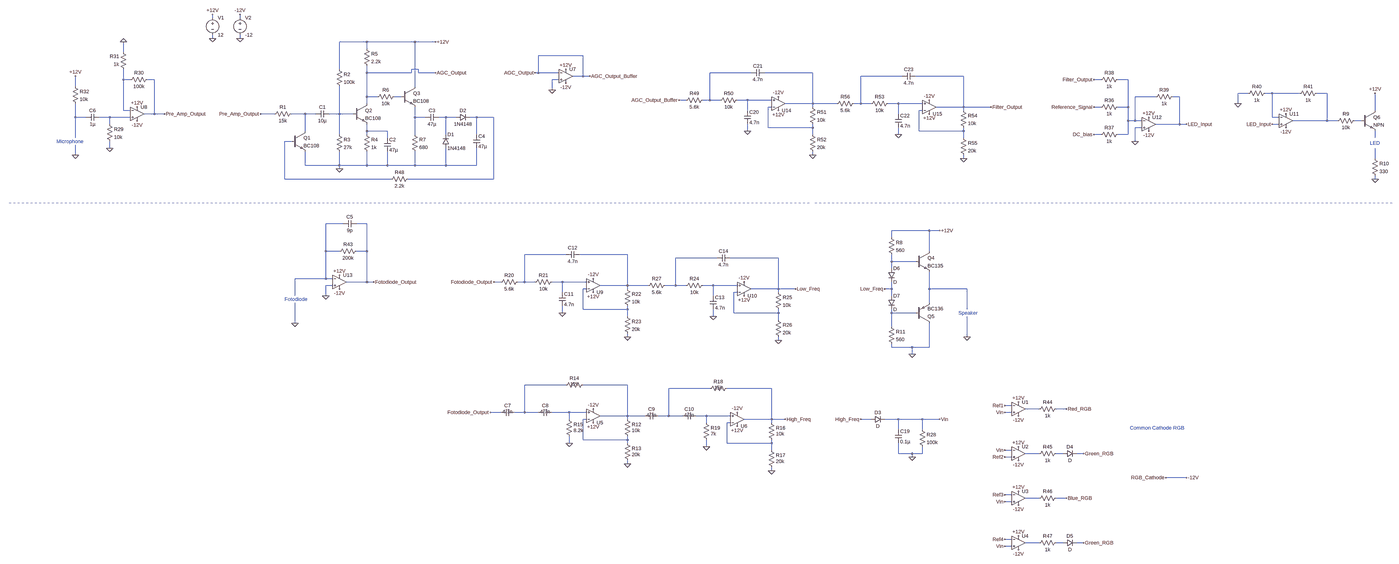
[diagram p0: schematic EE313_MenduhKesici_RafetKavak_CircuitSchematic.asc, whole sheet]
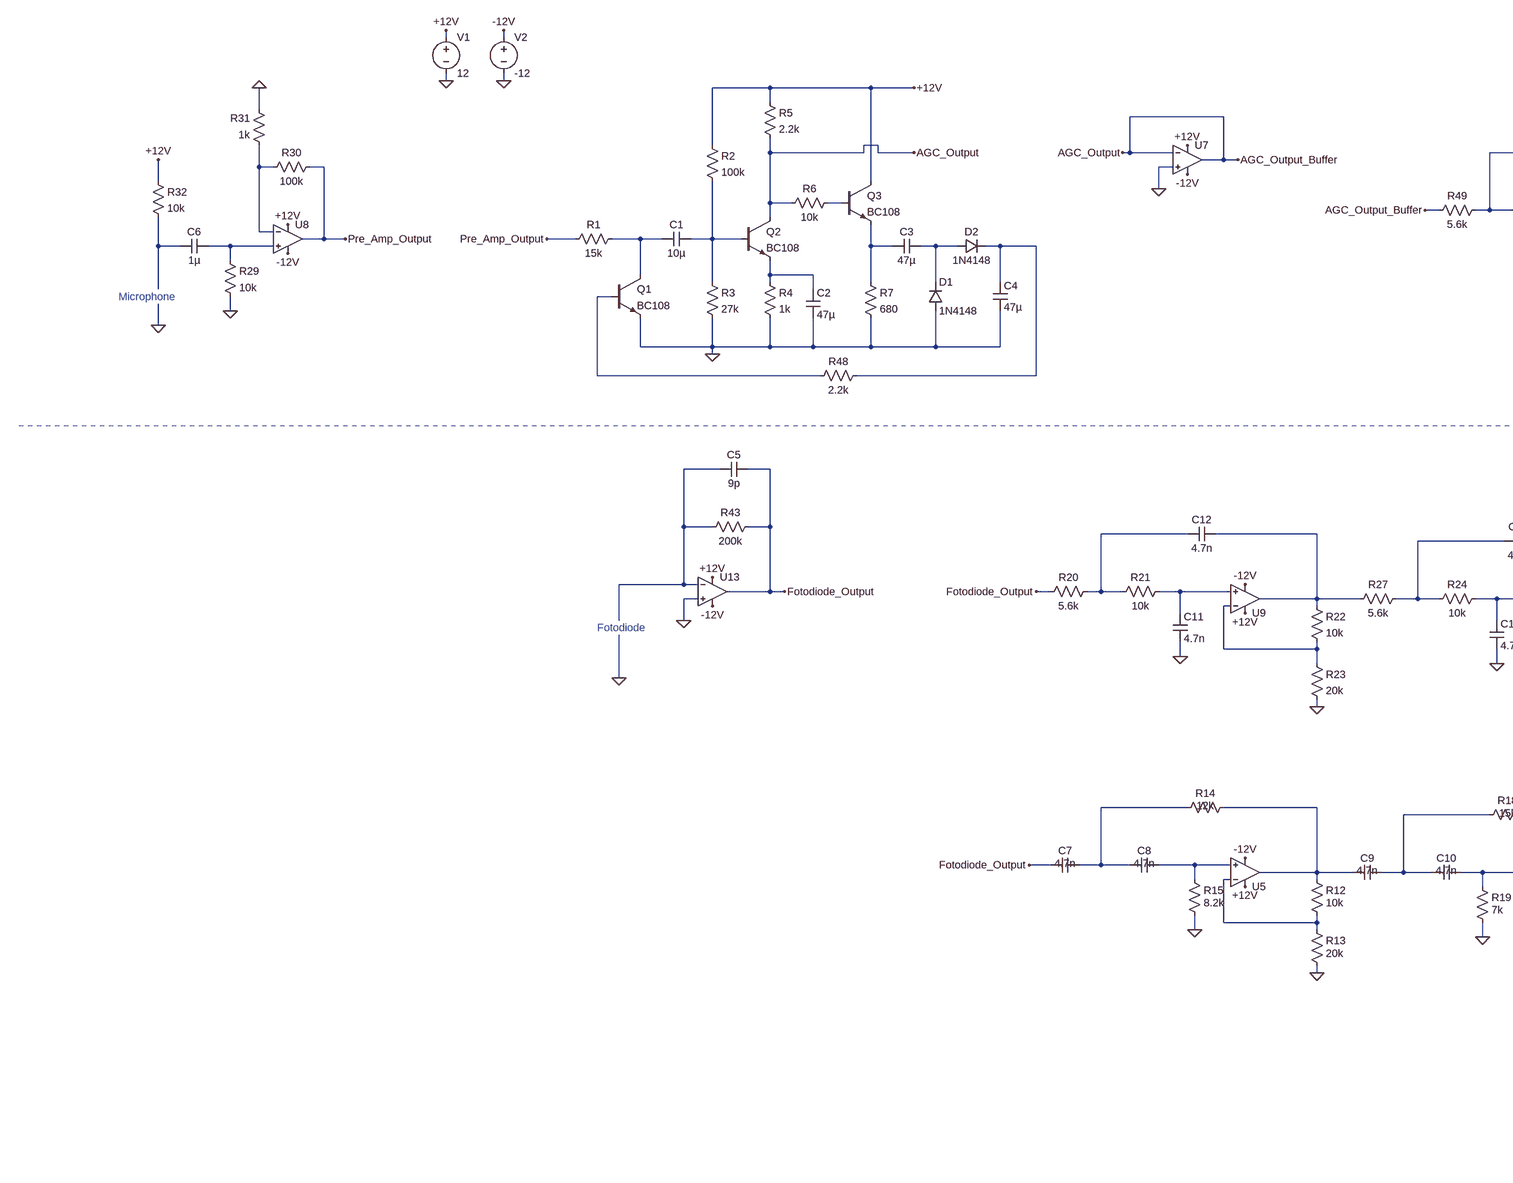
[diagram p1: schematic EE313_MenduhKesici_RafetKavak_CircuitSchematic.asc, part, row 1 of 1, column 1 of 2]
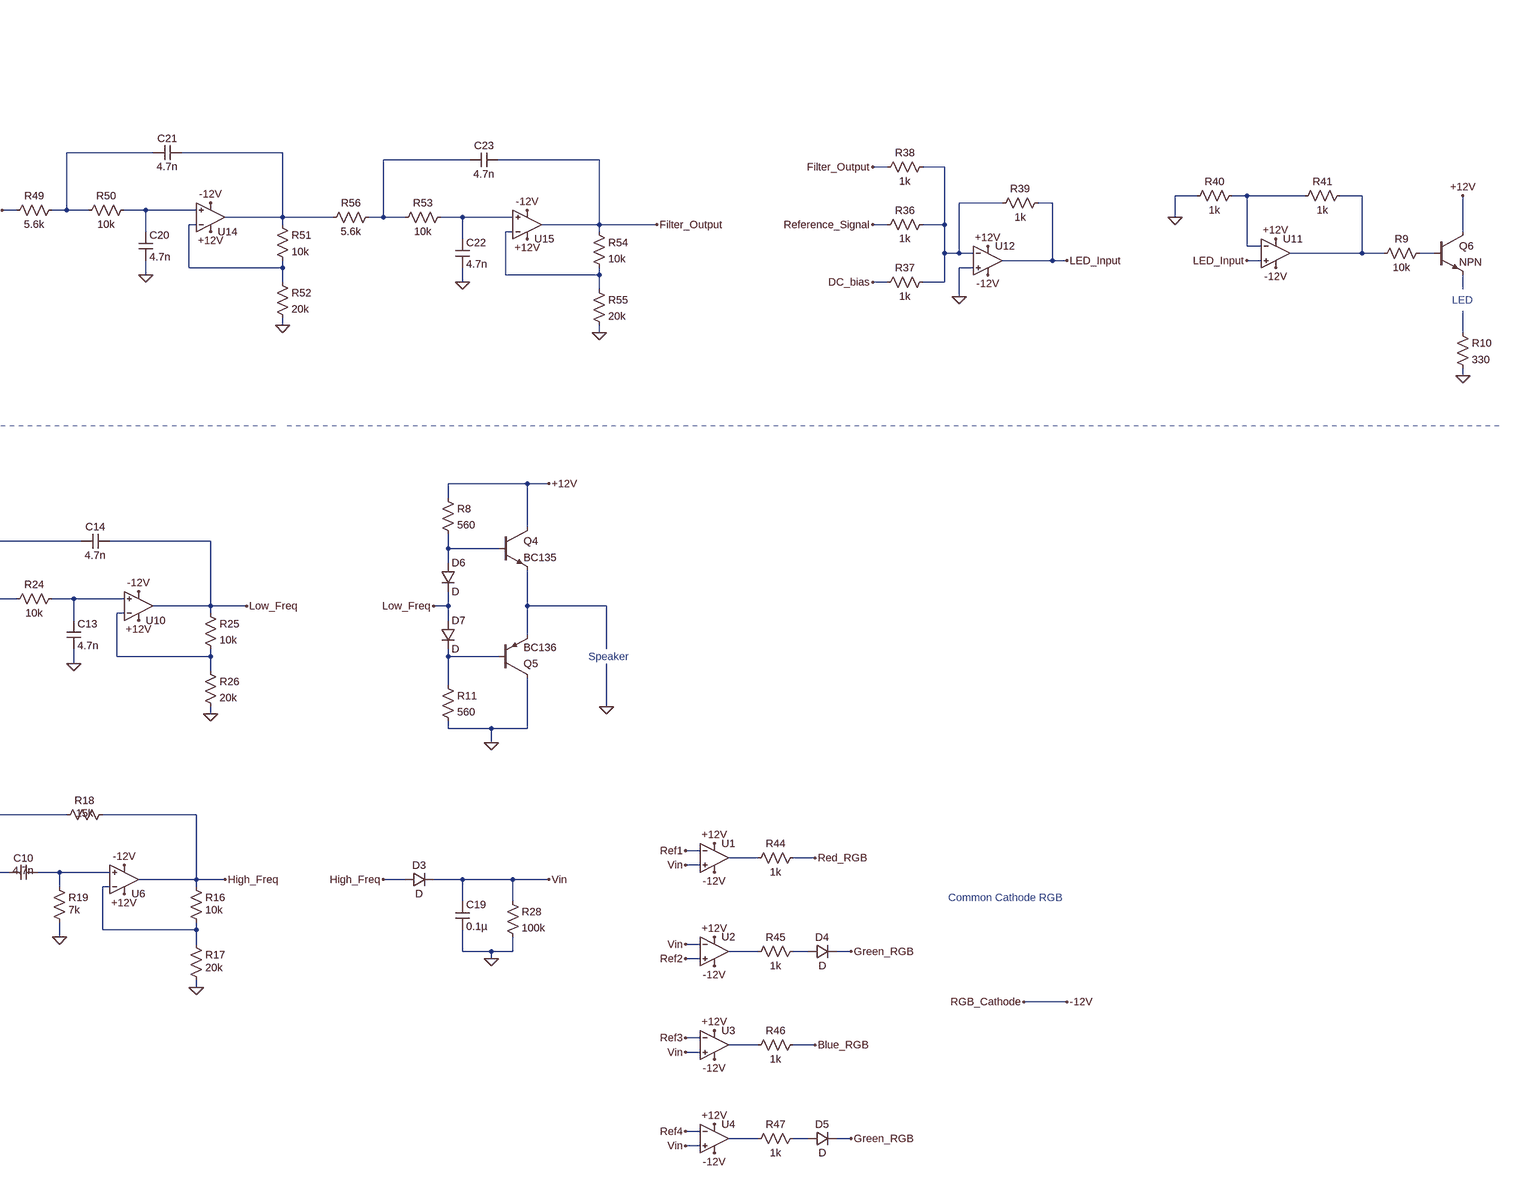
[diagram p2: schematic EE313_MenduhKesici_RafetKavak_CircuitSchematic.asc, part, row 1 of 1, column 2 of 2]
EE313_MenduhKesici_RafetKavak_CircuitSchematic.asc, the LTspice schematic file:
Version 4
SHEET 1 6596 3156
WIRE -2768 464 -2768 448
WIRE -2640 464 -2640 448
WIRE -2768 560 -2768 544
WIRE -2640 560 -2640 544
WIRE -2048 576 -2176 576
WIRE -1824 576 -2048 576
WIRE -1728 576 -1824 576
WIRE -2048 608 -2048 576
WIRE -3184 624 -3184 576
WIRE -1040 640 -1248 640
WIRE -2176 704 -2176 576
WIRE -1808 704 -1840 704
WIRE -2048 720 -2048 688
WIRE -1840 720 -1840 704
WIRE -1840 720 -2048 720
WIRE -1808 720 -1808 704
WIRE -1728 720 -1808 720
WIRE -1248 720 -1248 640
WIRE -1248 720 -1264 720
WIRE -1152 720 -1248 720
WIRE -256 720 -448 720
WIRE 32 720 -192 720
WIRE -1040 736 -1040 640
WIRE -1040 736 -1088 736
WIRE -1008 736 -1040 736
WIRE 448 736 256 736
WIRE 736 736 512 736
WIRE -3184 752 -3184 704
WIRE -3152 752 -3184 752
WIRE -3040 752 -3072 752
WIRE -1152 752 -1184 752
WIRE 1376 752 1344 752
WIRE 1504 752 1456 752
WIRE -3408 784 -3408 736
WIRE -1824 784 -1824 576
WIRE -1184 800 -1184 752
WIRE 2064 816 2016 816
WIRE 2176 816 2144 816
WIRE 2304 816 2176 816
WIRE 2432 816 2384 816
WIRE -2048 832 -2048 720
WIRE -2000 832 -2048 832
WIRE -1888 832 -1920 832
WIRE 1632 832 1536 832
WIRE 1744 832 1712 832
WIRE -560 848 -592 848
WIRE -448 848 -448 720
WIRE -448 848 -480 848
WIRE -400 848 -448 848
WIRE -272 848 -320 848
WIRE -160 848 -272 848
WIRE -2048 864 -2048 832
WIRE 32 864 32 720
WIRE 32 864 -96 864
WIRE 144 864 32 864
WIRE 256 864 256 736
WIRE 256 864 224 864
WIRE 304 864 256 864
WIRE 432 864 384 864
WIRE 544 864 432 864
WIRE 2016 864 2016 816
WIRE -160 880 -176 880
WIRE 32 880 32 864
WIRE 736 880 736 736
WIRE 736 880 608 880
WIRE 864 880 736 880
WIRE 1376 880 1344 880
WIRE 1504 880 1504 752
WIRE 1504 880 1456 880
WIRE -3184 896 -3184 752
WIRE -3152 896 -3184 896
WIRE -272 896 -272 848
WIRE 544 896 528 896
WIRE 736 896 736 880
WIRE 2656 896 2656 816
WIRE -3040 912 -3040 752
WIRE -3040 912 -3088 912
WIRE -2992 912 -3040 912
WIRE -2480 912 -2544 912
WIRE -2336 912 -2400 912
WIRE -2288 912 -2336 912
WIRE -2176 912 -2176 784
WIRE -2176 912 -2224 912
WIRE -2112 912 -2176 912
WIRE 432 912 432 864
WIRE -3408 928 -3408 864
WIRE -3360 928 -3408 928
WIRE -3248 928 -3296 928
WIRE -3152 928 -3248 928
WIRE -1824 928 -1824 880
WIRE -1776 928 -1824 928
WIRE -1680 928 -1712 928
WIRE -1632 928 -1680 928
WIRE -1536 928 -1568 928
WIRE -1456 928 -1536 928
WIRE 2176 928 2176 816
WIRE 2208 928 2176 928
WIRE 1504 944 1504 880
WIRE 1536 944 1536 832
WIRE 1536 944 1504 944
WIRE 1568 944 1536 944
WIRE 2432 944 2432 816
WIRE 2432 944 2272 944
WIRE 2480 944 2432 944
WIRE 2592 944 2560 944
WIRE -3248 960 -3248 928
WIRE 1744 960 1744 832
WIRE 1744 960 1632 960
WIRE 1776 960 1744 960
WIRE 2208 960 2176 960
WIRE -176 976 -176 880
WIRE 32 976 32 960
WIRE 32 976 -176 976
WIRE 1568 976 1536 976
WIRE -2336 992 -2336 912
WIRE -2048 992 -2048 960
WIRE -1952 992 -2048 992
WIRE -272 992 -272 960
WIRE 528 992 528 896
WIRE 736 992 736 976
WIRE 736 992 528 992
WIRE -2176 1008 -2176 912
WIRE -2048 1008 -2048 992
WIRE -1824 1008 -1824 928
WIRE -1680 1008 -1680 928
WIRE -1536 1008 -1536 928
WIRE 32 1008 32 976
WIRE 432 1008 432 976
WIRE 1376 1008 1344 1008
WIRE 1504 1008 1504 944
WIRE 1504 1008 1456 1008
WIRE -3408 1024 -3408 928
WIRE -1952 1024 -1952 992
WIRE 736 1024 736 992
WIRE 2656 1024 2656 992
WIRE -2400 1040 -2432 1040
WIRE 1536 1040 1536 976
WIRE -3248 1072 -3248 1040
WIRE -3408 1104 -3408 1056
WIRE 32 1104 32 1088
WIRE 736 1120 736 1104
WIRE 2656 1120 2656 1072
WIRE -2336 1152 -2336 1088
WIRE -2176 1152 -2176 1088
WIRE -2176 1152 -2336 1152
WIRE -2048 1152 -2048 1088
WIRE -2048 1152 -2176 1152
WIRE -1952 1152 -1952 1088
WIRE -1952 1152 -2048 1152
WIRE -1824 1152 -1824 1088
WIRE -1824 1152 -1952 1152
WIRE -1680 1152 -1680 1072
WIRE -1680 1152 -1824 1152
WIRE -1536 1152 -1536 1072
WIRE -1536 1152 -1680 1152
WIRE -2176 1168 -2176 1152
WIRE -2432 1216 -2432 1040
WIRE -1936 1216 -2432 1216
WIRE -1456 1216 -1456 928
WIRE -1456 1216 -1856 1216
WIRE 2656 1216 2656 1200
WIRE -2160 1424 -2240 1424
WIRE -2048 1424 -2096 1424
WIRE 576 1456 400 1456
WIRE 624 1456 576 1456
WIRE 400 1488 400 1456
WIRE -2240 1552 -2240 1424
WIRE -2176 1552 -2240 1552
WIRE -2048 1552 -2048 1424
WIRE -2048 1552 -2096 1552
WIRE 576 1552 576 1456
WIRE -1120 1568 -1312 1568
WIRE -832 1568 -1056 1568
WIRE -416 1584 -608 1584
WIRE -128 1584 -352 1584
WIRE 400 1600 400 1568
WIRE 512 1600 400 1600
WIRE 400 1632 400 1600
WIRE -2240 1680 -2240 1552
WIRE -2240 1680 -2384 1680
WIRE -2208 1680 -2240 1680
WIRE -2048 1696 -2048 1552
WIRE -2048 1696 -2144 1696
WIRE -2016 1696 -2048 1696
WIRE -1424 1696 -1456 1696
WIRE -1312 1696 -1312 1568
WIRE -1312 1696 -1344 1696
WIRE -1264 1696 -1312 1696
WIRE -1136 1696 -1184 1696
WIRE -1024 1696 -1136 1696
WIRE -2208 1712 -2240 1712
WIRE -832 1712 -832 1568
WIRE -832 1712 -960 1712
WIRE -736 1712 -832 1712
WIRE -608 1712 -608 1584
WIRE -608 1712 -656 1712
WIRE -560 1712 -608 1712
WIRE -432 1712 -480 1712
WIRE -320 1712 -432 1712
WIRE -1024 1728 -1040 1728
WIRE -832 1728 -832 1712
WIRE -128 1728 -128 1584
WIRE -128 1728 -256 1728
WIRE -48 1728 -128 1728
WIRE 400 1728 400 1696
WIRE 400 1728 368 1728
WIRE 576 1728 576 1648
WIRE 752 1728 576 1728
WIRE -1136 1744 -1136 1696
WIRE -320 1744 -336 1744
WIRE -128 1744 -128 1728
WIRE -2384 1760 -2384 1680
WIRE -2240 1760 -2240 1712
WIRE -432 1760 -432 1712
WIRE 400 1760 400 1728
WIRE 576 1792 576 1728
WIRE -1040 1824 -1040 1728
WIRE -832 1824 -832 1808
WIRE -832 1824 -1040 1824
WIRE 752 1824 752 1728
WIRE -1136 1840 -1136 1808
WIRE -336 1840 -336 1744
WIRE -128 1840 -128 1824
WIRE -128 1840 -336 1840
WIRE 400 1840 400 1824
WIRE 512 1840 400 1840
WIRE -832 1856 -832 1824
WIRE -432 1856 -432 1824
WIRE -128 1872 -128 1840
WIRE -2384 1888 -2384 1792
WIRE 400 1904 400 1840
WIRE -832 1952 -832 1936
WIRE 752 1952 752 1856
WIRE -128 1968 -128 1952
WIRE 400 2000 400 1984
WIRE 496 2000 400 2000
WIRE 576 2000 576 1888
WIRE 576 2000 496 2000
WIRE 496 2032 496 2000
WIRE -1120 2176 -1312 2176
WIRE -832 2176 -1040 2176
WIRE -448 2192 -640 2192
WIRE -160 2192 -368 2192
WIRE 960 2272 928 2272
WIRE 1088 2288 1024 2288
WIRE 1216 2288 1168 2288
WIRE -1424 2304 -1472 2304
WIRE -1312 2304 -1312 2176
WIRE -1312 2304 -1360 2304
WIRE -1248 2304 -1312 2304
WIRE -1104 2304 -1184 2304
WIRE -1024 2304 -1104 2304
WIRE 960 2304 928 2304
WIRE -832 2320 -832 2176
WIRE -832 2320 -960 2320
WIRE -752 2320 -832 2320
WIRE -640 2320 -640 2192
WIRE -640 2320 -688 2320
WIRE -576 2320 -640 2320
WIRE -464 2320 -512 2320
WIRE -352 2320 -464 2320
WIRE -1104 2336 -1104 2304
WIRE -1024 2336 -1040 2336
WIRE -832 2336 -832 2320
WIRE -160 2336 -160 2192
WIRE -160 2336 -288 2336
WIRE -96 2336 -160 2336
WIRE 304 2336 256 2336
WIRE 432 2336 368 2336
WIRE 544 2336 432 2336
WIRE 624 2336 544 2336
WIRE -464 2352 -464 2320
WIRE -352 2352 -368 2352
WIRE -160 2352 -160 2336
WIRE 432 2384 432 2336
WIRE 544 2384 544 2336
WIRE -1040 2432 -1040 2336
WIRE -832 2432 -832 2416
WIRE -832 2432 -1040 2432
WIRE -1104 2448 -1104 2416
WIRE -832 2448 -832 2432
WIRE -368 2448 -368 2352
WIRE -160 2448 -160 2432
WIRE -160 2448 -368 2448
WIRE -464 2464 -464 2432
WIRE -160 2480 -160 2448
WIRE 960 2480 928 2480
WIRE 432 2496 432 2448
WIRE 496 2496 432 2496
WIRE 544 2496 544 2464
WIRE 544 2496 496 2496
WIRE 1088 2496 1024 2496
WIRE 1200 2496 1168 2496
WIRE 1296 2496 1264 2496
WIRE 496 2512 496 2496
WIRE 960 2512 928 2512
WIRE -832 2544 -832 2528
WIRE -160 2576 -160 2560
WIRE 1776 2608 1680 2608
WIRE 960 2688 928 2688
WIRE 1088 2704 1024 2704
WIRE 1216 2704 1168 2704
WIRE 960 2720 928 2720
WIRE 960 2896 928 2896
WIRE 1088 2912 1024 2912
WIRE 1200 2912 1168 2912
WIRE 1296 2912 1264 2912
WIRE 960 2928 928 2928
FLAG 928 2304 Vin
FLAG 928 2480 Vin
FLAG 928 2720 Vin
FLAG 928 2928 Vin
FLAG 928 2272 Ref1
FLAG 928 2512 Ref2
FLAG 928 2688 Ref3
FLAG 928 2896 Ref4
FLAG 1296 2496 Green_RGB
FLAG 1216 2288 Red_RGB
FLAG 1216 2704 Blue_RGB
FLAG 1296 2912 Green_RGB
FLAG -1728 720 AGC_Output
FLAG -1728 576 +12V
FLAG -2176 1168 0
FLAG 624 1456 +12V
FLAG -1104 2448 0
FLAG -832 2544 0
FLAG -464 2464 0
FLAG -160 2576 0
FLAG -2768 560 0
FLAG -2640 560 0
FLAG -2768 448 +12V
FLAG -2640 448 -12V
FLAG -992 2352 +12V
FLAG -320 2368 +12V
FLAG -320 2304 -12V
FLAG -992 2288 -12V
FLAG 864 880 Filter_Output
FLAG 1536 1040 0
FLAG 1344 752 Filter_Output
FLAG 1344 880 Reference_Signal
FLAG 1344 1008 DC_bias
FLAG 1776 960 LED_Input
FLAG 2016 864 0
FLAG 2176 960 LED_Input
FLAG 1600 928 +12V
FLAG 1600 992 -12V
FLAG 2240 976 -12V
FLAG 2240 912 +12V
FLAG -2240 1760 0
FLAG -2384 1888 0
FLAG -2176 1664 +12V
FLAG -2176 1728 -12V
FLAG -2016 1696 Fotodiode_Output
FLAG -1456 1696 Fotodiode_Output
FLAG -1472 2304 Fotodiode_Output
FLAG -48 1728 Low_Freq
FLAG 496 2032 0
FLAG 368 1728 Low_Freq
FLAG -96 2336 High_Freq
FLAG 496 2512 0
FLAG 624 2336 Vin
FLAG 256 2336 High_Freq
FLAG 1680 2608 RGB_Cathode
FLAG 1776 2608 -12V
FLAG -272 992 0
FLAG 32 1104 0
FLAG -592 848 AGC_Output_Buffer
FLAG -128 896 +12V
FLAG -128 832 -12V
FLAG 432 1008 0
FLAG 736 1120 0
FLAG 576 912 +12V
FLAG 576 848 -12V
FLAG -1184 800 0
FLAG -1120 704 +12V
FLAG -1120 768 -12V
FLAG -1264 720 AGC_Output
FLAG -1008 736 AGC_Output_Buffer
FLAG -1136 1840 0
FLAG -832 1952 0
FLAG -992 1744 +12V
FLAG -992 1680 -12V
FLAG -432 1856 0
FLAG -128 1968 0
FLAG -288 1760 +12V
FLAG -288 1696 -12V
FLAG 2656 1216 0
FLAG 2656 816 +12V
FLAG 752 1952 0
FLAG -3408 1104 0
FLAG -3408 736 +12V
FLAG -3184 576 0
FLAG -3120 880 +12V
FLAG -3120 944 -12V
FLAG -3248 1072 0
FLAG -2992 912 Pre_Amp_Output
FLAG -2544 912 Pre_Amp_Output
FLAG 992 2528 -12V
FLAG 992 2320 -12V
FLAG 992 2736 -12V
FLAG 992 2944 -12V
FLAG 992 2256 +12V
FLAG 992 2464 +12V
FLAG 992 2672 +12V
FLAG 992 2880 +12V
SYMBOL Opamps\\UniversalOpamp2 992 2288 R0
SYMATTR InstName U1
SYMBOL Opamps\\UniversalOpamp2 992 2496 R0
SYMATTR InstName U2
SYMBOL Opamps\\UniversalOpamp2 992 2704 R0
SYMATTR InstName U3
SYMBOL Opamps\\UniversalOpamp2 992 2912 R0
SYMATTR InstName U4
SYMBOL npn -2400 992 R0
SYMATTR InstName Q1
SYMATTR Value BC108
SYMBOL npn -2112 864 R0
SYMATTR InstName Q2
SYMATTR Value BC108
SYMBOL cap -2224 896 R90
WINDOW 0 0 32 VBottom 2
WINDOW 3 32 32 VTop 2
SYMATTR InstName C1
SYMATTR Value 10µ
SYMBOL res -2384 896 R90
WINDOW 0 0 56 VBottom 2
WINDOW 3 32 56 VTop 2
SYMATTR InstName R1
SYMATTR Value 15k
SYMBOL res -2192 688 R0
SYMATTR InstName R2
SYMATTR Value 100k
SYMBOL res -2192 992 R0
SYMATTR InstName R3
SYMATTR Value 27k
SYMBOL res -2064 992 R0
SYMATTR InstName R4
SYMATTR Value 1k
SYMBOL cap -1968 1024 R0
SYMATTR InstName C2
SYMATTR Value 47µ
SYMBOL npn -1888 784 R0
SYMATTR InstName Q3
SYMATTR Value BC108
SYMBOL cap -1712 912 R90
WINDOW 0 0 32 VBottom 2
WINDOW 3 32 32 VTop 2
SYMATTR InstName C3
SYMATTR Value 47µ
SYMBOL res -2064 592 R0
SYMATTR InstName R5
SYMATTR Value 2.2k
SYMBOL res -1904 816 R90
WINDOW 0 0 56 VBottom 2
WINDOW 3 32 56 VTop 2
SYMATTR InstName R6
SYMATTR Value 10k
SYMBOL res -1840 992 R0
SYMATTR InstName R7
SYMATTR Value 680
SYMBOL diode -1696 1072 M180
WINDOW 0 24 64 Left 2
WINDOW 3 24 0 Left 2
SYMATTR InstName D1
SYMATTR Value 1N4148
SYMBOL diode -1632 912 M90
WINDOW 0 0 32 VBottom 2
WINDOW 3 32 32 VTop 2
SYMATTR InstName D2
SYMATTR Value 1N4148
SYMBOL cap -1552 1008 R0
SYMATTR InstName C4
SYMATTR Value 47µ
SYMBOL npn 512 1552 R0
SYMATTR InstName Q4
SYMATTR Value BC135
SYMBOL pnp 512 1888 M180
SYMATTR InstName Q5
SYMATTR Value BC136
SYMBOL res 384 1472 R0
SYMATTR InstName R8
SYMATTR Value 560
SYMBOL res 384 1888 R0
SYMATTR InstName R11
SYMATTR Value 560
SYMBOL Opamps\\UniversalOpamp2 -992 2320 M180
SYMATTR InstName U5
SYMBOL res -848 2320 R0
WINDOW 3 36 68 Left 2
SYMATTR Value 10k
SYMATTR InstName R12
SYMBOL res -848 2432 R0
WINDOW 3 36 68 Left 2
SYMATTR Value 20k
SYMATTR InstName R13
SYMBOL res -1024 2160 R90
WINDOW 0 0 56 VBottom 2
WINDOW 3 28 56 VBottom 2
SYMATTR InstName R14
SYMATTR Value 12k
SYMBOL res -1120 2320 R0
WINDOW 3 36 68 Left 2
SYMATTR Value 8.2k
SYMATTR InstName R15
SYMBOL cap -1360 2288 R90
WINDOW 0 0 32 VBottom 2
WINDOW 3 28 32 VBottom 2
SYMATTR InstName C7
SYMATTR Value 4.7n
SYMBOL cap -1184 2288 R90
WINDOW 0 0 32 VBottom 2
WINDOW 3 28 32 VBottom 2
SYMATTR InstName C8
SYMATTR Value 4.7n
SYMBOL Opamps\\UniversalOpamp2 -320 2336 M180
SYMATTR InstName U6
SYMBOL res -176 2336 R0
WINDOW 3 36 68 Left 2
SYMATTR Value 10k
SYMATTR InstName R16
SYMBOL res -176 2464 R0
WINDOW 3 36 68 Left 2
SYMATTR Value 20k
SYMATTR InstName R17
SYMBOL res -352 2176 R90
WINDOW 0 0 56 VBottom 2
WINDOW 3 28 56 VBottom 2
SYMATTR InstName R18
SYMATTR Value 15k
SYMBOL res -480 2336 R0
WINDOW 3 36 68 Left 2
SYMATTR Value 7k
SYMATTR InstName R19
SYMBOL cap -688 2304 R90
WINDOW 0 0 32 VBottom 2
WINDOW 3 28 32 VBottom 2
SYMATTR InstName C9
SYMATTR Value 4.7n
SYMBOL cap -512 2304 R90
WINDOW 0 0 32 VBottom 2
WINDOW 3 28 32 VBottom 2
SYMATTR InstName C10
SYMATTR Value 4.7n
SYMBOL voltage -2768 448 R0
WINDOW 123 0 0 Left 0
WINDOW 39 0 0 Left 0
SYMATTR InstName V1
SYMATTR Value 12
SYMBOL voltage -2640 448 R0
WINDOW 123 0 0 Left 0
WINDOW 39 0 0 Left 0
SYMATTR InstName V2
SYMATTR Value -12
SYMBOL Opamps\\UniversalOpamp2 2240 944 R0
SYMATTR InstName U11
SYMBOL Opamps\\UniversalOpamp2 1600 960 R0
SYMATTR InstName U12
SYMBOL res 1472 864 R90
WINDOW 0 0 56 VBottom 2
WINDOW 3 32 56 VTop 2
SYMATTR InstName R36
SYMATTR Value 1k
SYMBOL res 1472 992 R90
WINDOW 0 0 56 VBottom 2
WINDOW 3 32 56 VTop 2
SYMATTR InstName R37
SYMATTR Value 1k
SYMBOL res 1472 736 R90
WINDOW 0 0 56 VBottom 2
WINDOW 3 32 56 VTop 2
SYMATTR InstName R38
SYMATTR Value 1k
SYMBOL res 1728 816 R90
WINDOW 0 0 56 VBottom 2
WINDOW 3 32 56 VTop 2
SYMATTR InstName R39
SYMATTR Value 1k
SYMBOL res 2160 800 R90
WINDOW 0 0 56 VBottom 2
WINDOW 3 32 56 VTop 2
SYMATTR InstName R40
SYMATTR Value 1k
SYMBOL res 2400 800 R90
WINDOW 0 0 56 VBottom 2
WINDOW 3 32 56 VTop 2
SYMATTR InstName R41
SYMATTR Value 1k
SYMBOL Opamps\\UniversalOpamp2 -2176 1696 R0
SYMATTR InstName U13
SYMBOL res -2080 1536 R90
WINDOW 0 0 56 VBottom 2
WINDOW 3 32 56 VTop 2
SYMATTR InstName R43
SYMATTR Value 200k
SYMBOL diode 304 2352 R270
WINDOW 0 32 32 VTop 2
WINDOW 3 0 32 VBottom 2
SYMATTR InstName D3
SYMBOL cap 416 2384 R0
SYMATTR InstName C19
SYMATTR Value 0.1µ
SYMBOL res 1184 2272 R90
WINDOW 0 0 56 VBottom 2
WINDOW 3 32 56 VTop 2
SYMATTR InstName R44
SYMATTR Value 1k
SYMBOL res 1184 2480 R90
WINDOW 0 0 56 VBottom 2
WINDOW 3 32 56 VTop 2
SYMATTR InstName R45
SYMATTR Value 1k
SYMBOL res 1184 2688 R90
WINDOW 0 0 56 VBottom 2
WINDOW 3 32 56 VTop 2
SYMATTR InstName R46
SYMATTR Value 1k
SYMBOL res 1184 2896 R90
WINDOW 0 0 56 VBottom 2
WINDOW 3 32 56 VTop 2
SYMATTR InstName R47
SYMATTR Value 1k
SYMBOL diode 1200 2512 R270
WINDOW 0 32 32 VTop 2
WINDOW 3 0 32 VBottom 2
SYMATTR InstName D4
SYMBOL diode 1200 2928 R270
WINDOW 0 32 32 VTop 2
WINDOW 3 0 32 VBottom 2
SYMATTR InstName D5
SYMBOL res -1840 1200 R90
WINDOW 0 0 56 VBottom 2
WINDOW 3 32 56 VTop 2
SYMATTR InstName R48
SYMATTR Value 2.2k
SYMBOL Opamps\\UniversalOpamp2 -128 864 M180
SYMATTR InstName U14
SYMBOL res -464 832 R90
WINDOW 0 0 56 VBottom 2
WINDOW 3 32 56 VTop 2
SYMATTR InstName R49
SYMATTR Value 5.6k
SYMBOL res -304 832 R90
WINDOW 0 0 56 VBottom 2
WINDOW 3 32 56 VTop 2
SYMATTR InstName R50
SYMATTR Value 10k
SYMBOL cap -288 896 R0
SYMATTR InstName C20
SYMATTR Value 4.7n
SYMBOL res 16 864 R0
SYMATTR InstName R51
SYMATTR Value 10k
SYMBOL res 16 992 R0
SYMATTR InstName R52
SYMATTR Value 20k
SYMBOL cap -192 704 R90
WINDOW 0 0 32 VBottom 2
WINDOW 3 32 32 VTop 2
SYMATTR InstName C21
SYMATTR Value 4.7n
SYMBOL Opamps\\UniversalOpamp2 576 880 M180
SYMATTR InstName U15
SYMBOL res 400 848 R90
WINDOW 0 0 56 VBottom 2
WINDOW 3 32 56 VTop 2
SYMATTR InstName R53
SYMATTR Value 10k
SYMBOL cap 416 912 R0
SYMATTR InstName C22
SYMATTR Value 4.7n
SYMBOL res 720 880 R0
SYMATTR InstName R54
SYMATTR Value 10k
SYMBOL res 720 1008 R0
SYMATTR InstName R55
SYMATTR Value 20k
SYMBOL cap 512 720 R90
WINDOW 0 0 32 VBottom 2
WINDOW 3 32 32 VTop 2
SYMATTR InstName C23
SYMATTR Value 4.7n
SYMBOL res 240 848 R90
WINDOW 0 0 56 VBottom 2
WINDOW 3 32 56 VTop 2
SYMATTR InstName R56
SYMATTR Value 5.6k
SYMBOL Opamps\\UniversalOpamp2 -1120 736 R0
SYMATTR InstName U7
SYMBOL Opamps\\UniversalOpamp2 -992 1712 M180
SYMATTR InstName U9
SYMBOL res -1328 1680 R90
WINDOW 0 0 56 VBottom 2
WINDOW 3 32 56 VTop 2
SYMATTR InstName R20
SYMATTR Value 5.6k
SYMBOL res -1168 1680 R90
WINDOW 0 0 56 VBottom 2
WINDOW 3 32 56 VTop 2
SYMATTR InstName R21
SYMATTR Value 10k
SYMBOL cap -1152 1744 R0
SYMATTR InstName C11
SYMATTR Value 4.7n
SYMBOL res -848 1712 R0
SYMATTR InstName R22
SYMATTR Value 10k
SYMBOL res -848 1840 R0
SYMATTR InstName R23
SYMATTR Value 20k
SYMBOL cap -1056 1552 R90
WINDOW 0 0 32 VBottom 2
WINDOW 3 32 32 VTop 2
SYMATTR InstName C12
SYMATTR Value 4.7n
SYMBOL Opamps\\UniversalOpamp2 -288 1728 M180
SYMATTR InstName U10
SYMBOL res -464 1696 R90
WINDOW 0 0 56 VBottom 2
WINDOW 3 32 56 VTop 2
SYMATTR InstName R24
SYMATTR Value 10k
SYMBOL cap -448 1760 R0
SYMATTR InstName C13
SYMATTR Value 4.7n
SYMBOL res -144 1728 R0
SYMATTR InstName R25
SYMATTR Value 10k
SYMBOL res -144 1856 R0
SYMATTR InstName R26
SYMATTR Value 20k
SYMBOL cap -352 1568 R90
WINDOW 0 0 32 VBottom 2
WINDOW 3 32 32 VTop 2
SYMATTR InstName C14
SYMATTR Value 4.7n
SYMBOL res -640 1696 R90
WINDOW 0 0 56 VBottom 2
WINDOW 3 32 56 VTop 2
SYMATTR InstName R27
SYMATTR Value 5.6k
SYMBOL diode 384 1632 R0
SYMATTR InstName D6
SYMBOL diode 384 1760 R0
SYMATTR InstName D7
SYMBOL npn 2592 896 R0
SYMATTR InstName Q6
SYMBOL res 2576 928 R90
WINDOW 0 0 56 VBottom 2
WINDOW 3 32 56 VTop 2
SYMATTR InstName R9
SYMATTR Value 10k
SYMBOL res 2640 1104 R0
SYMATTR InstName R10
SYMATTR Value 330
SYMBOL res 528 2368 R0
SYMATTR InstName R28
SYMATTR Value 100k
SYMBOL cap -2160 1408 M90
WINDOW 0 0 32 VBottom 2
WINDOW 3 32 32 VTop 2
SYMATTR InstName C5
SYMATTR Value 9p
SYMBOL Opamps\\UniversalOpamp2 -3120 912 R0
SYMATTR InstName U8
SYMBOL cap -3296 912 R90
WINDOW 0 0 32 VBottom 2
WINDOW 3 32 32 VTop 2
SYMATTR InstName C6
SYMATTR Value 1µ
SYMBOL res -3264 944 R0
SYMATTR InstName R29
SYMATTR Value 10k
SYMBOL res -3056 736 R90
WINDOW 0 0 56 VBottom 2
WINDOW 3 32 56 VTop 2
SYMATTR InstName R30
SYMATTR Value 100k
SYMBOL res -3168 720 R180
WINDOW 0 36 76 Left 2
WINDOW 3 36 40 Left 2
SYMATTR InstName R31
SYMATTR Value 1k
SYMBOL res -3424 768 R0
SYMATTR InstName R32
SYMATTR Value 10k
TEXT -3496 1040 Left 2 ;Microphone
TEXT -2432 1776 Left 2 ;Fotodiode
TEXT 1512 2376 Left 2 ;Common Cathode RGB
TEXT 2632 1048 Left 2 ;LED
TEXT 712 1840 Left 2 ;Speaker
LINE Normal -64 1328 -3728 1328 2
LINE Normal 16 1328 -64 1328 2
LINE Normal 2736 1328 32 1328 2

The netlist it stands for:
* EE313_MenduhKesici_RafetKavak_CircuitSchematic.asc
XU1 Vin Ref1 +12V RGB_Cathode N039 level.2 Avol=1Meg GBW=10Meg Slew=10Meg ilimit=25m rail=0 Vos=0 phimargin=45 en=0 enk=0 in=0 ink=0 Rin=500Meg  ; pins IN+ IN- V+ V- OUT
XU2 Ref2 Vin +12V RGB_Cathode N044 level.2 Avol=1Meg GBW=10Meg Slew=10Meg ilimit=25m rail=0 Vos=0 phimargin=45 en=0 enk=0 in=0 ink=0 Rin=500Meg  ; pins IN+ IN- V+ V- OUT
XU3 Vin Ref3 +12V RGB_Cathode N046 level.2 Avol=1Meg GBW=10Meg Slew=10Meg ilimit=25m rail=0 Vos=0 phimargin=45 en=0 enk=0 in=0 ink=0 Rin=500Meg  ; pins IN+ IN- V+ V- OUT
XU4 Vin Ref4 +12V RGB_Cathode N047 level.2 Avol=1Meg GBW=10Meg Slew=10Meg ilimit=25m rail=0 Vos=0 phimargin=45 en=0 enk=0 in=0 ink=0 Rin=500Meg  ; pins IN+ IN- V+ V- OUT
Q1 N013 N023 0 0 BC108
Q2 AGC_Output_Buffer N014 N021 0 BC108
C1 N014 N013 10µ
R1 N013 Pre_Amp_Output 15k
R2 +12V N014 100k
R3 N014 0 27k
R4 N021 0 1k
C2 N021 0 47µ
Q3 +12V N008 N017 0 BC108
C3 N018 N017 47µ
R5 +12V AGC_Output_Buffer 2.2k
R6 N008 AGC_Output_Buffer 10k
R7 N017 0 680
D1 0 N018 1N4148
D2 N018 N019 1N4148
C4 N019 0 47µ
Q4 +12V N029 N033 0 BC135
Q5 0 N035 N033 0 BC136
R8 +12V N029 560
R11 N035 0 560
XU5 N040 N042 +12V RGB_Cathode N037 level.2 Avol=1Meg GBW=10Meg Slew=10Meg ilimit=25m rail=0 Vos=0 phimargin=45 en=0 enk=0 in=0 ink=0 Rin=500Meg  ; pins IN+ IN- V+ V- OUT
R12 N037 N042 10k
R13 N042 0 20k
R14 N037 N036 12k
R15 N040 0 8.2k
C7 N036 Fotodiode_Output 4.7n
C8 N040 N036 4.7n
XU6 N041 N043 +12V RGB_Cathode High_Freq level.2 Avol=1Meg GBW=10Meg Slew=10Meg ilimit=25m rail=0 Vos=0 phimargin=45 en=0 enk=0 in=0 ink=0 Rin=500Meg  ; pins IN+ IN- V+ V- OUT
R16 High_Freq N043 10k
R17 N043 0 20k
R18 High_Freq N038 15k
R19 N041 0 7k
C9 N038 N037 4.7n
C10 N041 N038 4.7n
V1 +12V 0 12
V2 RGB_Cathode 0 -12
XU11 LED_Input N006 +12V RGB_Cathode N007 level.2 Avol=1Meg GBW=10Meg Slew=10Meg ilimit=25m rail=0 Vos=0 phimargin=45 en=0 enk=0 in=0 ink=0 Rin=500Meg  ; pins IN+ IN- V+ V- OUT
XU12 0 N005 +12V RGB_Cathode LED_Input level.2 Avol=1Meg GBW=10Meg Slew=10Meg ilimit=25m rail=0 Vos=0 phimargin=45 en=0 enk=0 in=0 ink=0 Rin=500Meg  ; pins IN+ IN- V+ V- OUT
R36 N005 Reference_Signal 1k
R37 N005 DC_bias 1k
R38 N005 Filter_Output 1k
R39 LED_Input N005 1k
R40 N006 0 1k
R41 N007 N006 1k
XU13 0 N025 +12V RGB_Cathode Fotodiode_Output level.2 Avol=1Meg GBW=10Meg Slew=10Meg ilimit=25m rail=0 Vos=0 phimargin=45 en=0 enk=0 in=0 ink=0 Rin=500Meg  ; pins IN+ IN- V+ V- OUT
R43 Fotodiode_Output N025 200k
D3 High_Freq Vin D
C19 Vin 0 0.1µ
R44 Red_RGB N039 1k
R45 N045 N044 1k
R46 Blue_RGB N046 1k
R47 N048 N047 1k
D4 N045 Green_RGB D
D5 N048 Green_RGB D
R48 N019 N023 2.2k
XU14 N009 N011 +12V RGB_Cathode N002 level.2 Avol=1Meg GBW=10Meg Slew=10Meg ilimit=25m rail=0 Vos=0 phimargin=45 en=0 enk=0 in=0 ink=0 Rin=500Meg  ; pins IN+ IN- V+ V- OUT
R49 N001 AGC_Output_Buffer 5.6k
R50 N009 N001 10k
C20 N009 0 4.7n
R51 N002 N011 10k
R52 N011 0 20k
C21 N002 N001 4.7n
XU15 N010 N012 +12V RGB_Cathode Filter_Output level.2 Avol=1Meg GBW=10Meg Slew=10Meg ilimit=25m rail=0 Vos=0 phimargin=45 en=0 enk=0 in=0 ink=0 Rin=500Meg  ; pins IN+ IN- V+ V- OUT
R53 N010 N003 10k
C22 N010 0 4.7n
R54 Filter_Output N012 10k
R55 N012 0 20k
C23 Filter_Output N003 4.7n
R56 N003 N002 5.6k
XU7 0 AGC_Output_Buffer +12V RGB_Cathode AGC_Output_Buffer level.2 Avol=1Meg GBW=10Meg Slew=10Meg ilimit=25m rail=0 Vos=0 phimargin=45 en=0 enk=0 in=0 ink=0 Rin=500Meg  ; pins IN+ IN- V+ V- OUT
XU9 N030 N032 +12V RGB_Cathode N027 level.2 Avol=1Meg GBW=10Meg Slew=10Meg ilimit=25m rail=0 Vos=0 phimargin=45 en=0 enk=0 in=0 ink=0 Rin=500Meg  ; pins IN+ IN- V+ V- OUT
R20 N026 Fotodiode_Output 5.6k
R21 N030 N026 10k
C11 N030 0 4.7n
R22 N027 N032 10k
R23 N032 0 20k
C12 N027 N026 4.7n
XU10 N031 N034 +12V RGB_Cathode Low_Freq level.2 Avol=1Meg GBW=10Meg Slew=10Meg ilimit=25m rail=0 Vos=0 phimargin=45 en=0 enk=0 in=0 ink=0 Rin=500Meg  ; pins IN+ IN- V+ V- OUT
R24 N031 N028 10k
C13 N031 0 4.7n
R25 Low_Freq N034 10k
R26 N034 0 20k
C14 Low_Freq N028 4.7n
R27 N028 N027 5.6k
D6 N029 Low_Freq D
D7 Low_Freq N035 D
Q6 +12V N020 N022 0 NPN
R9 N020 N007 10k
R10 N024 0 330
R28 Vin 0 100k
C5 N025 Fotodiode_Output 9p
XU8 N016 N004 +12V RGB_Cathode Pre_Amp_Output level.2 Avol=1Meg GBW=10Meg Slew=10Meg ilimit=25m rail=0 Vos=0 phimargin=45 en=0 enk=0 in=0 ink=0 Rin=500Meg  ; pins IN+ IN- V+ V- OUT
C6 N016 N015 1µ
R29 N016 0 10k
R30 Pre_Amp_Output N004 100k
R31 N004 0 1k
R32 +12V N015 10k
.model D D
.lib standard.dio
.model NPN NPN
.model PNP PNP
.lib standard.bjt
* Microphone
* Fotodiode
* Common Cathode RGB
* LED
* Speaker
.lib UniversalOpamps2.sub
.backanno
.end